# Vivado block design vitis_design, xcvc1902-vsva2197-2MP-e-S, Vivado 2024.1
# (continued, part 3 of 3)
create_bd_cell -type ip -vlnv xilinx.com:ip:axi_noc:1.1 cips_noc
set_property -dict [list \
  CONFIG.NUM_CLKS 10 \
  CONFIG.NUM_MC 0 \
  CONFIG.NUM_MI 1 \
  CONFIG.NUM_NMI 8 \
  CONFIG.NUM_NSI 0 \
  CONFIG.NUM_SI 8 \
] [get_bd_cells cips_noc]
create_bd_cell -type ip -vlnv xilinx.com:ip:axi_noc:1.1 noc_ddr4
set_property -dict [list \
  CONFIG.CH0_DDR4_0_BOARD_INTERFACE ddr4_dimm1 \
  CONFIG.MC_CHAN_REGION0 DDR_LOW0 \
  CONFIG.MC_CHAN_REGION1 DDR_LOW1 \
  CONFIG.MC_DDR4_2T Disable \
  CONFIG.MC_F1_LPDDR4_MR1 0x0000 \
  CONFIG.MC_F1_LPDDR4_MR2 0x0000 \
  CONFIG.MC_F1_TRCD 13750 \
  CONFIG.MC_F1_TRCDMIN 13750 \
  CONFIG.MC_PRE_DEF_ADDR_MAP_SEL ROW_COLUMN_BANK \
  CONFIG.MC_TRC 45750 \
  CONFIG.MC_TRCD 13750 \
  CONFIG.MC_TRCDMIN 13750 \
  CONFIG.MC_TRCMIN 45750 \
  CONFIG.MC_TRP 13750 \
  CONFIG.MC_TRPMIN 13750 \
  CONFIG.NUM_CLKS 1 \
  CONFIG.NUM_MC 1 \
  CONFIG.NUM_MCP 4 \
  CONFIG.NUM_MI 0 \
  CONFIG.NUM_NSI 4 \
  CONFIG.NUM_SI 3 \
  CONFIG.sys_clk0_BOARD_INTERFACE ddr4_dimm1_sma_clk \
] [get_bd_cells noc_ddr4]
create_bd_cell -type ip -vlnv xilinx.com:ip:axi_noc:1.1 noc_lpddr4
set_property -dict [list \
  CONFIG.CH0_LPDDR4_0_BOARD_INTERFACE ch0_lpddr4_c0 \
  CONFIG.CH0_LPDDR4_1_BOARD_INTERFACE ch0_lpddr4_c1 \
  CONFIG.CH1_LPDDR4_0_BOARD_INTERFACE ch1_lpddr4_c0 \
  CONFIG.CH1_LPDDR4_1_BOARD_INTERFACE ch1_lpddr4_c1 \
  CONFIG.MC_CHAN_REGION0 DDR_CH1 \
  CONFIG.MC_CHAN_REGION1 NONE \
  CONFIG.NUM_CLKS 0 \
  CONFIG.NUM_MCP 4 \
  CONFIG.NUM_MI 0 \
  CONFIG.NUM_NSI 4 \
  CONFIG.NUM_SI 0 \
  CONFIG.sys_clk0_BOARD_INTERFACE lpddr4_sma_clk1 \
  CONFIG.sys_clk1_BOARD_INTERFACE lpddr4_sma_clk2 \
] [get_bd_cells noc_lpddr4]
create_bd_cell -type ip -vlnv xilinx.com:ip:ai_engine:2.0 ai_engine_0
set_property -dict [list \
  CONFIG.AIE_CORE_REF_CTRL_FREQMHZ 1250 \
  CONFIG.CLK_NAMES aclk0, \
  CONFIG.C_EN_EXT_RST 1 \
  CONFIG.NAME_MI_AXIS M00_AXIS, \
  CONFIG.NAME_SI_AXI S00_AXI, \
  CONFIG.NAME_SI_AXIS S00_AXIS,S01_AXIS, \
  CONFIG.NUM_CLKS 1 \
  CONFIG.NUM_MI_AXI 0 \
  CONFIG.NUM_MI_AXIS 1 \
  CONFIG.NUM_SI_AXI 1 \
  CONFIG.NUM_SI_AXIS 2 \
] [get_bd_cells ai_engine_0]
create_bd_cell -type ip -vlnv xilinx.com:ip:axi_intc:4.1 axi_intc_cascaded_1
set_property -dict {CONFIG.C_ASYNC_INTR 0xFFFFFFFF CONFIG.C_IRQ_CONNECTION 1} [get_bd_cells axi_intc_cascaded_1]
create_bd_cell -type ip -vlnv xilinx.com:ip:axi_intc:4.1 axi_intc_parent
set_property -dict {CONFIG.C_ASYNC_INTR 0xFFFFFFFF CONFIG.C_IRQ_CONNECTION 1} [get_bd_cells axi_intc_parent]
create_bd_cell -type ip -vlnv xilinx.com:ip:xlconcat:2.1 xlconcat_0
set_property -dict {CONFIG.IN0_WIDTH 1 CONFIG.NUM_PORTS 32} [get_bd_cells xlconcat_0]
create_bd_cell -type ip -vlnv xilinx.com:ip:clk_wizard:1.0 clk_wizard_0
set_property -dict [list \
  CONFIG.CE_TYPE HARDSYNC \
  CONFIG.CLKOUT_DRIVES BUFG,BUFG,BUFG,MBUFGCE,BUFG,BUFG,BUFG \
  CONFIG.CLKOUT_DYN_PS None,None,None,None,None,None,None \
  CONFIG.CLKOUT_GROUPING Auto,Auto,Auto,Auto,Auto,Auto,Auto \
  CONFIG.CLKOUT_MATCHED_ROUTING false,false,false,false,false,false,false \
  CONFIG.CLKOUT_PORT clk_out1,clk_out2,clk_out3,clk_out4_o1,clk_out4_o2,clk_out4_o3,clk_out4_o4 \
  CONFIG.CLKOUT_REQUESTED_DUTY_CYCLE 50.000,50.000,50.000,50.000,50.000,50.000,50.000 \
  CONFIG.CLKOUT_REQUESTED_OUT_FREQUENCY 104.167,208.33,416.67,625,312.5,156.25,78.125 \
  CONFIG.CLKOUT_REQUESTED_PHASE 0.000,0.000,0.000,0.000,0.000,0.000,0.000 \
  CONFIG.CLKOUT_USED true,true,true,true,false,false,false \
  CONFIG.JITTER_SEL Min_O_Jitter \
  CONFIG.PRIM_IN_FREQ 100.000 \
  CONFIG.PRIM_SOURCE Global_buffer \
  CONFIG.RESET_TYPE ACTIVE_LOW \
  CONFIG.USE_PHASE_ALIGNMENT true \
] [get_bd_cells clk_wizard_0]
create_bd_cell -type ip -vlnv xilinx.com:ip:proc_sys_reset:5.0 psr_104mhz
create_bd_cell -type ip -vlnv xilinx.com:ip:proc_sys_reset:5.0 psr_156mhz
create_bd_cell -type ip -vlnv xilinx.com:ip:proc_sys_reset:5.0 psr_312mhz
create_bd_cell -type ip -vlnv xilinx.com:ip:proc_sys_reset:5.0 psr_78mhz
create_bd_cell -type ip -vlnv xilinx.com:ip:proc_sys_reset:5.0 psr_208mhz
create_bd_cell -type ip -vlnv xilinx.com:ip:proc_sys_reset:5.0 psr_416mhz
create_bd_cell -type ip -vlnv xilinx.com:ip:proc_sys_reset:5.0 psr_625mhz
create_bd_cell -type ip -vlnv xilinx.com:ip:smartconnect:1.0 icn_ctrl_1
set_property -dict {CONFIG.NUM_CLKS 3 CONFIG.NUM_MI 11 CONFIG.NUM_SI 1} [get_bd_cells icn_ctrl_1]
create_bd_cell -type ip -vlnv xilinx.com:ip:smartconnect:1.0 icn_ctrl_2
set_property -dict {CONFIG.NUM_CLKS 1 CONFIG.NUM_MI 1 CONFIG.NUM_SI 1} [get_bd_cells icn_ctrl_2]
create_bd_cell -type ip -vlnv xilinx.com:ip:axi_vip:1.1 dummy_slave_0
set_property -dict {CONFIG.INTERFACE_MODE SLAVE CONFIG.PROTOCOL AXI4LITE} [get_bd_cells dummy_slave_0]
create_bd_cell -type ip -vlnv xilinx.com:ip:axi_vip:1.1 dummy_slave_1
set_property -dict {CONFIG.INTERFACE_MODE SLAVE CONFIG.PROTOCOL AXI4LITE} [get_bd_cells dummy_slave_1]
create_bd_cell -type ip -vlnv xilinx.com:ip:axi_vip:1.1 dummy_slave_2
set_property -dict {CONFIG.INTERFACE_MODE SLAVE CONFIG.PROTOCOL AXI4LITE} [get_bd_cells dummy_slave_2]
create_bd_cell -type ip -vlnv xilinx.com:ip:axi_vip:1.1 dummy_slave_3
set_property -dict {CONFIG.INTERFACE_MODE SLAVE CONFIG.PROTOCOL AXI4LITE} [get_bd_cells dummy_slave_3]
create_bd_cell -type ip -vlnv xilinx.com:ip:smartconnect:1.0 icn_ctrl_3
set_property -dict {CONFIG.NUM_CLKS 1 CONFIG.NUM_MI 1 CONFIG.NUM_SI 1} [get_bd_cells icn_ctrl_3]
create_bd_cell -type ip -vlnv xilinx.com:ip:smartconnect:1.0 icn_ctrl_4
set_property -dict {CONFIG.NUM_CLKS 1 CONFIG.NUM_MI 1 CONFIG.NUM_SI 1} [get_bd_cells icn_ctrl_4]
create_bd_cell -type ip -vlnv xilinx.com:ip:smartconnect:1.0 icn_ctrl_5
set_property -dict {CONFIG.NUM_CLKS 1 CONFIG.NUM_MI 1 CONFIG.NUM_SI 1} [get_bd_cells icn_ctrl_5]
create_bd_cell -type ip -vlnv xilinx.com:ip:xlconstant:1.1 xlconstant_0
create_bd_cell -type hier VitisRegion

# ---- hierarchy /VitisRegion ----
current_bd_instance /VitisRegion
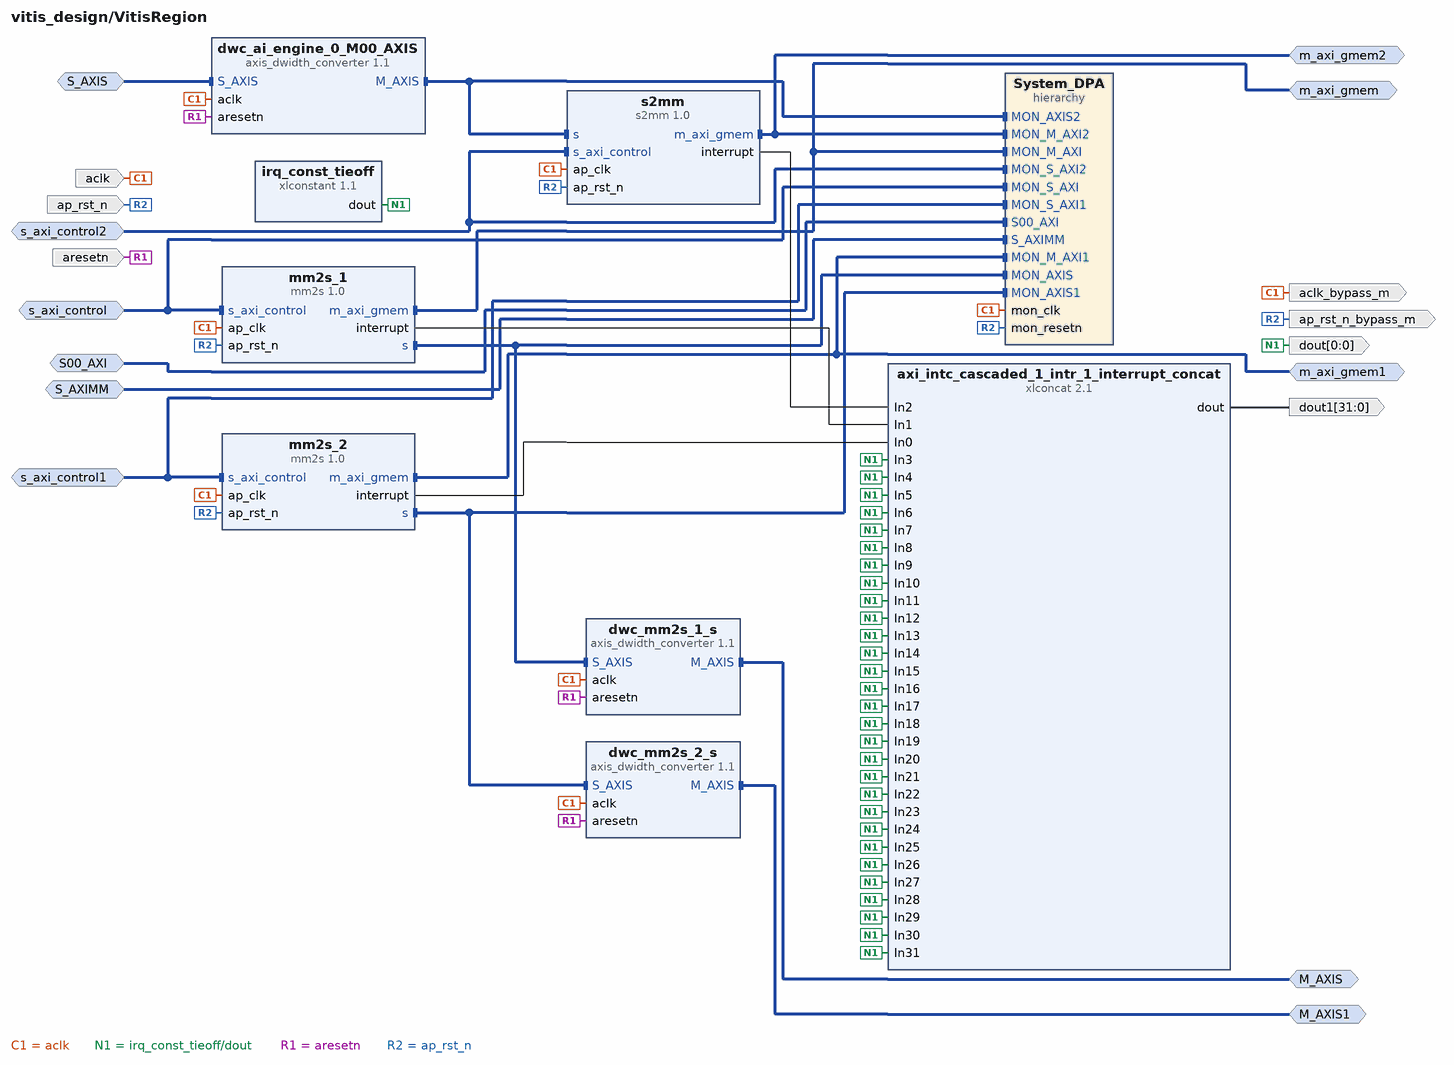
[diagram p1: block diagram inside /VitisRegion]
create_bd_intf_pin -mode Slave -vlnv xilinx.com:interface:aximm_rtl:1.0 S00_AXI
create_bd_intf_pin -mode Slave -vlnv xilinx.com:interface:aximm_rtl:1.0 S_AXIMM
create_bd_intf_pin -mode Master -vlnv xilinx.com:interface:aximm_rtl:1.0 m_axi_gmem
create_bd_intf_pin -mode Slave -vlnv xilinx.com:interface:aximm_rtl:1.0 s_axi_control
create_bd_intf_pin -mode Master -vlnv xilinx.com:interface:aximm_rtl:1.0 m_axi_gmem1
create_bd_intf_pin -mode Slave -vlnv xilinx.com:interface:aximm_rtl:1.0 s_axi_control1
create_bd_intf_pin -mode Master -vlnv xilinx.com:interface:aximm_rtl:1.0 m_axi_gmem2
create_bd_intf_pin -mode Slave -vlnv xilinx.com:interface:aximm_rtl:1.0 s_axi_control2
create_bd_intf_pin -mode Slave -vlnv xilinx.com:interface:axis_rtl:1.0 S_AXIS
create_bd_intf_pin -mode Master -vlnv xilinx.com:interface:axis_rtl:1.0 M_AXIS
create_bd_intf_pin -mode Master -vlnv xilinx.com:interface:axis_rtl:1.0 M_AXIS1
create_bd_pin -dir I -type clk aclk
create_bd_pin -dir I -type rst ap_rst_n
create_bd_pin -dir O -from 0 -to 0 dout
create_bd_pin -dir O -from 31 -to 0 dout1
create_bd_pin -dir I -type rst aresetn
create_bd_pin -dir O -type clk aclk_bypass_m
create_bd_pin -dir O -type rst ap_rst_n_bypass_m

create_bd_cell -type hier System_DPA
create_bd_cell -type ip -vlnv xilinx.com:ip:xlconcat:2.1 axi_intc_cascaded_1_intr_1_interrupt_concat
set_property -dict {CONFIG.NUM_PORTS 32} [get_bd_cells axi_intc_cascaded_1_intr_1_interrupt_concat]
create_bd_cell -type ip -vlnv xilinx.com:ip:axis_dwidth_converter:1.1 dwc_ai_engine_0_M00_AXIS
set_property -dict {CONFIG.M_TDATA_NUM_BYTES 4 CONFIG.S_TDATA_NUM_BYTES 16} [get_bd_cells dwc_ai_engine_0_M00_AXIS]
create_bd_cell -type ip -vlnv xilinx.com:ip:axis_dwidth_converter:1.1 dwc_mm2s_1_s
set_property -dict {CONFIG.M_TDATA_NUM_BYTES 16 CONFIG.S_TDATA_NUM_BYTES 4} [get_bd_cells dwc_mm2s_1_s]
create_bd_cell -type ip -vlnv xilinx.com:ip:axis_dwidth_converter:1.1 dwc_mm2s_2_s
set_property -dict {CONFIG.M_TDATA_NUM_BYTES 16 CONFIG.S_TDATA_NUM_BYTES 4} [get_bd_cells dwc_mm2s_2_s]
create_bd_cell -type ip -vlnv xilinx.com:ip:xlconstant:1.1 irq_const_tieoff
set_property -dict {CONFIG.CONST_VAL 0 CONFIG.CONST_WIDTH 1} [get_bd_cells irq_const_tieoff]
create_bd_cell -type ip -vlnv xilinx.com:hls:mm2s:1.0 mm2s_1
create_bd_cell -type ip -vlnv xilinx.com:hls:mm2s:1.0 mm2s_2
create_bd_cell -type ip -vlnv xilinx.com:hls:s2mm:1.0 s2mm

# ---- hierarchy /VitisRegion/System_DPA ----
current_bd_instance /VitisRegion/System_DPA
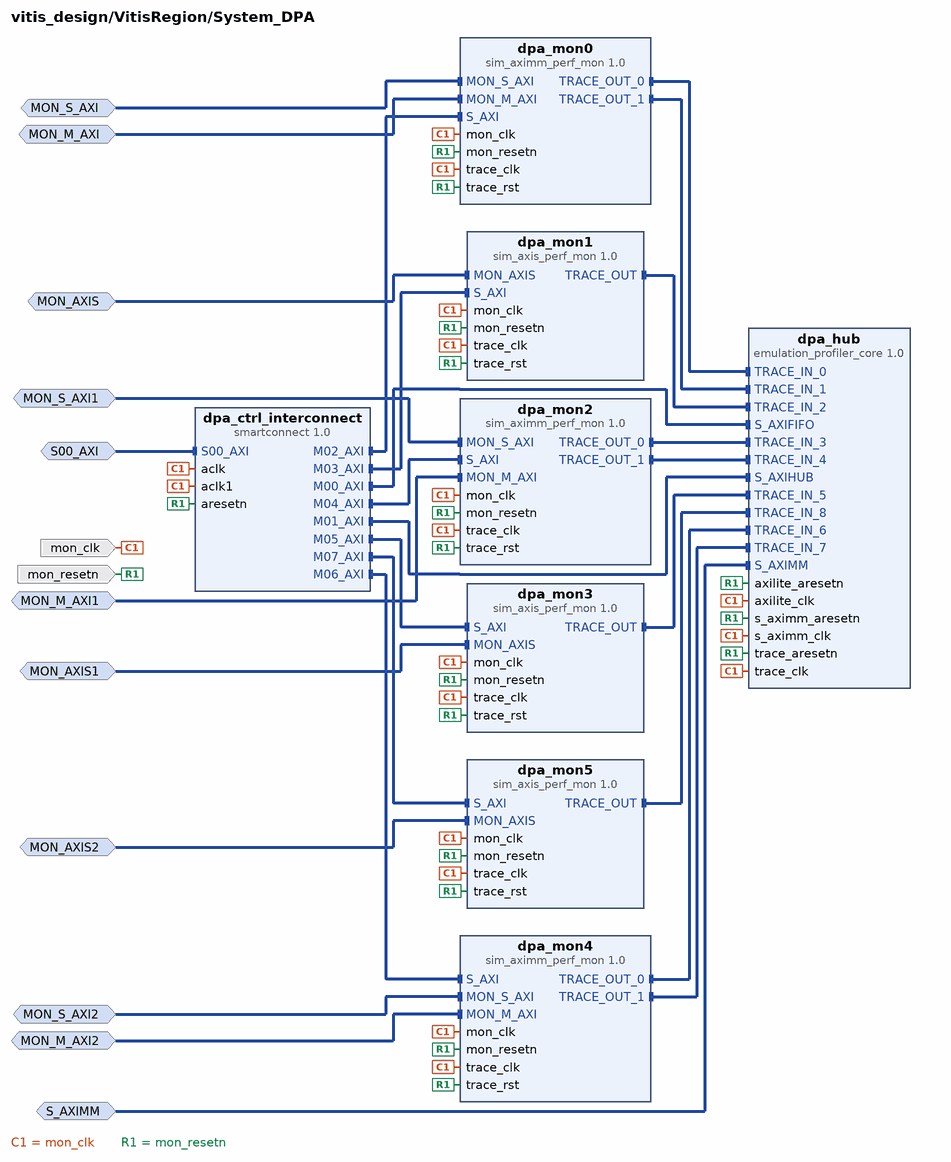
[diagram p2: block diagram inside /VitisRegion/System_DPA]
create_bd_intf_pin -mode Slave -vlnv xilinx.com:interface:aximm_rtl:1.0 S00_AXI
create_bd_intf_pin -mode Slave -vlnv xilinx.com:interface:aximm_rtl:1.0 S_AXIMM
create_bd_intf_pin -mode Monitor -vlnv xilinx.com:interface:aximm_rtl:1.0 MON_M_AXI
create_bd_intf_pin -mode Monitor -vlnv xilinx.com:interface:aximm_rtl:1.0 MON_S_AXI
create_bd_intf_pin -mode Monitor -vlnv xilinx.com:interface:axis_rtl:1.0 MON_AXIS
create_bd_intf_pin -mode Monitor -vlnv xilinx.com:interface:aximm_rtl:1.0 MON_M_AXI1
create_bd_intf_pin -mode Monitor -vlnv xilinx.com:interface:aximm_rtl:1.0 MON_S_AXI1
create_bd_intf_pin -mode Monitor -vlnv xilinx.com:interface:axis_rtl:1.0 MON_AXIS1
create_bd_intf_pin -mode Monitor -vlnv xilinx.com:interface:aximm_rtl:1.0 MON_M_AXI2
create_bd_intf_pin -mode Monitor -vlnv xilinx.com:interface:aximm_rtl:1.0 MON_S_AXI2
create_bd_intf_pin -mode Monitor -vlnv xilinx.com:interface:axis_rtl:1.0 MON_AXIS2
create_bd_pin -dir I -type clk mon_clk
create_bd_pin -dir I -type rst mon_resetn

create_bd_cell -type ip -vlnv xilinx.com:ip:smartconnect:1.0 dpa_ctrl_interconnect
set_property -dict {CONFIG.HAS_ARESETN 1 CONFIG.NUM_CLKS 2 CONFIG.NUM_MI 8 CONFIG.NUM_SI 1} [get_bd_cells dpa_ctrl_interconnect]
create_bd_cell -type ip -vlnv xilinx.com:ip:emulation_profiler_core:1.0 dpa_hub
set_property -dict [list \
  CONFIG.NUM_TRACE_PORTS 9 \
  CONFIG.S_AXIMM_ADDR_RANGE 16777216 \
  CONFIG.S_AXIMM_DATA_WIDTH 32 \
] [get_bd_cells dpa_hub]
create_bd_cell -type ip -vlnv xilinx.com:ip:sim_aximm_perf_mon:1.0 dpa_mon0
set_property -dict [list \
  CONFIG.CAPTURE_BURSTS 0 \
  CONFIG.COUNT_WIDTH 64 \
  CONFIG.ENABLE_COUNTERS true \
  CONFIG.ENABLE_DEBUG true \
  CONFIG.ENABLE_TRACE true \
  CONFIG.EN_AXI_LITE 1 \
  CONFIG.MODE_SDACCEL true \
  CONFIG.MONITOR_ID mm2s_1:m_axi_gmem-DDR \
  CONFIG.TRACE_READ_ID 0 \
  CONFIG.TRACE_WRITE_ID 1 \
] [get_bd_cells dpa_mon0]
create_bd_cell -type ip -vlnv xilinx.com:ip:sim_axis_perf_mon:1.0 dpa_mon1
set_property -dict [list \
  CONFIG.DETAILED_TRACE 1 \
  CONFIG.ENABLE_TRACE 1 \
  CONFIG.EN_AXI_LITE true \
  CONFIG.MONITOR_ID mm2s_1:s-dwc_mm2s_1_s:S_AXIS \
  CONFIG.TRACE_ID 576 \
] [get_bd_cells dpa_mon1]
create_bd_cell -type ip -vlnv xilinx.com:ip:sim_aximm_perf_mon:1.0 dpa_mon2
set_property -dict [list \
  CONFIG.CAPTURE_BURSTS 0 \
  CONFIG.COUNT_WIDTH 64 \
  CONFIG.ENABLE_COUNTERS true \
  CONFIG.ENABLE_DEBUG true \
  CONFIG.ENABLE_TRACE true \
  CONFIG.EN_AXI_LITE 1 \
  CONFIG.MODE_SDACCEL true \
  CONFIG.MONITOR_ID mm2s_2:m_axi_gmem-DDR \
  CONFIG.TRACE_READ_ID 2 \
  CONFIG.TRACE_WRITE_ID 3 \
] [get_bd_cells dpa_mon2]
create_bd_cell -type ip -vlnv xilinx.com:ip:sim_axis_perf_mon:1.0 dpa_mon3
set_property -dict [list \
  CONFIG.DETAILED_TRACE 1 \
  CONFIG.ENABLE_TRACE 1 \
  CONFIG.EN_AXI_LITE true \
  CONFIG.MONITOR_ID mm2s_2:s-dwc_mm2s_2_s:S_AXIS \
  CONFIG.TRACE_ID 577 \
] [get_bd_cells dpa_mon3]
create_bd_cell -type ip -vlnv xilinx.com:ip:sim_aximm_perf_mon:1.0 dpa_mon4
set_property -dict [list \
  CONFIG.CAPTURE_BURSTS 0 \
  CONFIG.COUNT_WIDTH 64 \
  CONFIG.ENABLE_COUNTERS true \
  CONFIG.ENABLE_DEBUG true \
  CONFIG.ENABLE_TRACE true \
  CONFIG.EN_AXI_LITE 1 \
  CONFIG.MODE_SDACCEL true \
  CONFIG.MONITOR_ID s2mm:m_axi_gmem-DDR \
  CONFIG.TRACE_READ_ID 4 \
  CONFIG.TRACE_WRITE_ID 5 \
] [get_bd_cells dpa_mon4]
create_bd_cell -type ip -vlnv xilinx.com:ip:sim_axis_perf_mon:1.0 dpa_mon5
set_property -dict [list \
  CONFIG.DETAILED_TRACE 1 \
  CONFIG.ENABLE_TRACE 1 \
  CONFIG.EN_AXI_LITE true \
  CONFIG.MONITOR_ID dwc_ai_engine_0_M00_AXIS:M_AXIS-s2mm:s \
  CONFIG.TRACE_ID 578 \
] [get_bd_cells dpa_mon5]

# ---- connections ----

current_bd_instance /VitisRegion
connect_bd_intf_net -intf_net ai_engine_0_M00_AXIS [get_bd_intf_pins S_AXIS] [get_bd_intf_pins dwc_ai_engine_0_M00_AXIS/S_AXIS]
connect_bd_intf_net [get_bd_intf_pins dwc_ai_engine_0_M00_AXIS/M_AXIS] [get_bd_intf_pins s2mm/s]
connect_bd_intf_net [get_bd_intf_pins dwc_ai_engine_0_M00_AXIS/M_AXIS] [get_bd_intf_pins System_DPA/MON_AXIS2]
connect_bd_intf_net [get_bd_intf_pins M_AXIS] [get_bd_intf_pins dwc_mm2s_1_s/M_AXIS]
connect_bd_intf_net [get_bd_intf_pins M_AXIS1] [get_bd_intf_pins dwc_mm2s_2_s/M_AXIS]
connect_bd_intf_net -intf_net icn_ctrl_1_M06_AXI [get_bd_intf_pins s_axi_control] [get_bd_intf_pins mm2s_1/s_axi_control]
connect_bd_intf_net [get_bd_intf_pins s_axi_control] [get_bd_intf_pins System_DPA/MON_S_AXI]
connect_bd_intf_net -intf_net icn_ctrl_1_M07_AXI [get_bd_intf_pins s_axi_control1] [get_bd_intf_pins mm2s_2/s_axi_control]
connect_bd_intf_net [get_bd_intf_pins s_axi_control1] [get_bd_intf_pins System_DPA/MON_S_AXI1]
connect_bd_intf_net -intf_net icn_ctrl_1_M08_AXI [get_bd_intf_pins s_axi_control2] [get_bd_intf_pins s2mm/s_axi_control]
connect_bd_intf_net [get_bd_intf_pins s_axi_control2] [get_bd_intf_pins System_DPA/MON_S_AXI2]
connect_bd_intf_net -intf_net icn_ctrl_1_M09_AXI [get_bd_intf_pins S00_AXI] [get_bd_intf_pins System_DPA/S00_AXI]
connect_bd_intf_net -intf_net icn_ctrl_1_M10_AXI [get_bd_intf_pins S_AXIMM] [get_bd_intf_pins System_DPA/S_AXIMM]
connect_bd_intf_net [get_bd_intf_pins m_axi_gmem] [get_bd_intf_pins mm2s_1/m_axi_gmem]
connect_bd_intf_net [get_bd_intf_pins m_axi_gmem] [get_bd_intf_pins System_DPA/MON_M_AXI]
connect_bd_intf_net [get_bd_intf_pins mm2s_1/s] [get_bd_intf_pins dwc_mm2s_1_s/S_AXIS]
connect_bd_intf_net [get_bd_intf_pins mm2s_1/s] [get_bd_intf_pins System_DPA/MON_AXIS]
connect_bd_intf_net [get_bd_intf_pins m_axi_gmem1] [get_bd_intf_pins mm2s_2/m_axi_gmem]
connect_bd_intf_net [get_bd_intf_pins m_axi_gmem1] [get_bd_intf_pins System_DPA/MON_M_AXI1]
connect_bd_intf_net [get_bd_intf_pins mm2s_2/s] [get_bd_intf_pins dwc_mm2s_2_s/S_AXIS]
connect_bd_intf_net [get_bd_intf_pins mm2s_2/s] [get_bd_intf_pins System_DPA/MON_AXIS1]
connect_bd_intf_net [get_bd_intf_pins m_axi_gmem2] [get_bd_intf_pins s2mm/m_axi_gmem]
connect_bd_intf_net [get_bd_intf_pins m_axi_gmem2] [get_bd_intf_pins System_DPA/MON_M_AXI2]
connect_bd_net [get_bd_pins axi_intc_cascaded_1_intr_1_interrupt_concat/dout] [get_bd_pins dout1]
connect_bd_net -net clk_wizard_0_clk_out4_o1_o2 [get_bd_pins aclk] \
  [get_bd_pins dwc_ai_engine_0_M00_AXIS/aclk] [get_bd_pins dwc_mm2s_1_s/aclk] [get_bd_pins dwc_mm2s_2_s/aclk] \
  [get_bd_pins mm2s_1/ap_clk] [get_bd_pins mm2s_2/ap_clk] [get_bd_pins s2mm/ap_clk] [get_bd_pins System_DPA/mon_clk] \
  [get_bd_pins aclk_bypass_m]
connect_bd_net [get_bd_pins irq_const_tieoff/dout] \
  [get_bd_pins dout] [get_bd_pins axi_intc_cascaded_1_intr_1_interrupt_concat/In4] \
  [get_bd_pins axi_intc_cascaded_1_intr_1_interrupt_concat/In5] [get_bd_pins axi_intc_cascaded_1_intr_1_interrupt_concat/In6] \
  [get_bd_pins axi_intc_cascaded_1_intr_1_interrupt_concat/In7] [get_bd_pins axi_intc_cascaded_1_intr_1_interrupt_concat/In8] \
  [get_bd_pins axi_intc_cascaded_1_intr_1_interrupt_concat/In9] \
  [get_bd_pins axi_intc_cascaded_1_intr_1_interrupt_concat/In10] \
  [get_bd_pins axi_intc_cascaded_1_intr_1_interrupt_concat/In11] \
  [get_bd_pins axi_intc_cascaded_1_intr_1_interrupt_concat/In12] \
  [get_bd_pins axi_intc_cascaded_1_intr_1_interrupt_concat/In13] \
  [get_bd_pins axi_intc_cascaded_1_intr_1_interrupt_concat/In14] \
  [get_bd_pins axi_intc_cascaded_1_intr_1_interrupt_concat/In15] \
  [get_bd_pins axi_intc_cascaded_1_intr_1_interrupt_concat/In16] \
  [get_bd_pins axi_intc_cascaded_1_intr_1_interrupt_concat/In17] \
  [get_bd_pins axi_intc_cascaded_1_intr_1_interrupt_concat/In18] \
  [get_bd_pins axi_intc_cascaded_1_intr_1_interrupt_concat/In19] \
  [get_bd_pins axi_intc_cascaded_1_intr_1_interrupt_concat/In20] \
  [get_bd_pins axi_intc_cascaded_1_intr_1_interrupt_concat/In21] \
  [get_bd_pins axi_intc_cascaded_1_intr_1_interrupt_concat/In22] \
  [get_bd_pins axi_intc_cascaded_1_intr_1_interrupt_concat/In23] \
  [get_bd_pins axi_intc_cascaded_1_intr_1_interrupt_concat/In24] \
  [get_bd_pins axi_intc_cascaded_1_intr_1_interrupt_concat/In25] \
  [get_bd_pins axi_intc_cascaded_1_intr_1_interrupt_concat/In26] \
  [get_bd_pins axi_intc_cascaded_1_intr_1_interrupt_concat/In27] \
  [get_bd_pins axi_intc_cascaded_1_intr_1_interrupt_concat/In28] \
  [get_bd_pins axi_intc_cascaded_1_intr_1_interrupt_concat/In29] \
  [get_bd_pins axi_intc_cascaded_1_intr_1_interrupt_concat/In30] \
  [get_bd_pins axi_intc_cascaded_1_intr_1_interrupt_concat/In31] \
  [get_bd_pins axi_intc_cascaded_1_intr_1_interrupt_concat/In3]
connect_bd_net [get_bd_pins mm2s_1/interrupt] [get_bd_pins axi_intc_cascaded_1_intr_1_interrupt_concat/In1]
connect_bd_net [get_bd_pins mm2s_2/interrupt] [get_bd_pins axi_intc_cascaded_1_intr_1_interrupt_concat/In0]
connect_bd_net -net psr_312mhz_interconnect_aresetn [get_bd_pins aresetn] \
  [get_bd_pins dwc_mm2s_1_s/aresetn] [get_bd_pins dwc_mm2s_2_s/aresetn] [get_bd_pins dwc_ai_engine_0_M00_AXIS/aresetn]
connect_bd_net -net psr_312mhz_peripheral_aresetn [get_bd_pins ap_rst_n] \
  [get_bd_pins mm2s_1/ap_rst_n] [get_bd_pins mm2s_2/ap_rst_n] [get_bd_pins s2mm/ap_rst_n] [get_bd_pins System_DPA/mon_resetn] \
  [get_bd_pins ap_rst_n_bypass_m]
connect_bd_net [get_bd_pins s2mm/interrupt] [get_bd_pins axi_intc_cascaded_1_intr_1_interrupt_concat/In2]

current_bd_instance /VitisRegion/System_DPA
connect_bd_intf_net [get_bd_intf_pins dpa_hub/S_AXIFIFO] [get_bd_intf_pins dpa_ctrl_interconnect/M00_AXI]
connect_bd_intf_net [get_bd_intf_pins dpa_hub/S_AXIHUB] [get_bd_intf_pins dpa_ctrl_interconnect/M01_AXI]
connect_bd_intf_net [get_bd_intf_pins dpa_mon0/S_AXI] [get_bd_intf_pins dpa_ctrl_interconnect/M02_AXI]
connect_bd_intf_net [get_bd_intf_pins dpa_mon1/S_AXI] [get_bd_intf_pins dpa_ctrl_interconnect/M03_AXI]
connect_bd_intf_net [get_bd_intf_pins dpa_mon2/S_AXI] [get_bd_intf_pins dpa_ctrl_interconnect/M04_AXI]
connect_bd_intf_net [get_bd_intf_pins dpa_mon3/S_AXI] [get_bd_intf_pins dpa_ctrl_interconnect/M05_AXI]
connect_bd_intf_net [get_bd_intf_pins dpa_mon4/S_AXI] [get_bd_intf_pins dpa_ctrl_interconnect/M06_AXI]
connect_bd_intf_net [get_bd_intf_pins dpa_mon5/S_AXI] [get_bd_intf_pins dpa_ctrl_interconnect/M07_AXI]
connect_bd_intf_net [get_bd_intf_pins dpa_mon0/TRACE_OUT_0] [get_bd_intf_pins dpa_hub/TRACE_IN_0]
connect_bd_intf_net [get_bd_intf_pins dpa_mon0/TRACE_OUT_1] [get_bd_intf_pins dpa_hub/TRACE_IN_1]
connect_bd_intf_net [get_bd_intf_pins dpa_mon1/TRACE_OUT] [get_bd_intf_pins dpa_hub/TRACE_IN_2]
connect_bd_intf_net [get_bd_intf_pins dpa_mon2/TRACE_OUT_0] [get_bd_intf_pins dpa_hub/TRACE_IN_3]
connect_bd_intf_net [get_bd_intf_pins dpa_mon2/TRACE_OUT_1] [get_bd_intf_pins dpa_hub/TRACE_IN_4]
connect_bd_intf_net [get_bd_intf_pins dpa_mon3/TRACE_OUT] [get_bd_intf_pins dpa_hub/TRACE_IN_5]
connect_bd_intf_net [get_bd_intf_pins dpa_mon4/TRACE_OUT_0] [get_bd_intf_pins dpa_hub/TRACE_IN_6]
connect_bd_intf_net [get_bd_intf_pins dpa_mon4/TRACE_OUT_1] [get_bd_intf_pins dpa_hub/TRACE_IN_7]
connect_bd_intf_net [get_bd_intf_pins dpa_mon5/TRACE_OUT] [get_bd_intf_pins dpa_hub/TRACE_IN_8]
connect_bd_intf_net -intf_net dwc_ai_engine_0_M00_AXIS_M_AXIS [get_bd_intf_pins MON_AXIS2] [get_bd_intf_pins dpa_mon5/MON_AXIS]
connect_bd_intf_net -intf_net icn_ctrl_1_M06_AXI [get_bd_intf_pins MON_S_AXI] [get_bd_intf_pins dpa_mon0/MON_S_AXI]
connect_bd_intf_net -intf_net icn_ctrl_1_M07_AXI [get_bd_intf_pins MON_S_AXI1] [get_bd_intf_pins dpa_mon2/MON_S_AXI]
connect_bd_intf_net -intf_net icn_ctrl_1_M08_AXI [get_bd_intf_pins MON_S_AXI2] [get_bd_intf_pins dpa_mon4/MON_S_AXI]
connect_bd_intf_net -intf_net icn_ctrl_1_M09_AXI [get_bd_intf_pins S00_AXI] [get_bd_intf_pins dpa_ctrl_interconnect/S00_AXI]
connect_bd_intf_net -intf_net icn_ctrl_1_M10_AXI [get_bd_intf_pins S_AXIMM] [get_bd_intf_pins dpa_hub/S_AXIMM]
connect_bd_intf_net -intf_net mm2s_1_m_axi_gmem [get_bd_intf_pins MON_M_AXI] [get_bd_intf_pins dpa_mon0/MON_M_AXI]
connect_bd_intf_net -intf_net mm2s_1_s [get_bd_intf_pins MON_AXIS] [get_bd_intf_pins dpa_mon1/MON_AXIS]
connect_bd_intf_net -intf_net mm2s_2_m_axi_gmem [get_bd_intf_pins MON_M_AXI1] [get_bd_intf_pins dpa_mon2/MON_M_AXI]
connect_bd_intf_net -intf_net mm2s_2_s [get_bd_intf_pins MON_AXIS1] [get_bd_intf_pins dpa_mon3/MON_AXIS]
connect_bd_intf_net -intf_net s2mm_m_axi_gmem [get_bd_intf_pins MON_M_AXI2] [get_bd_intf_pins dpa_mon4/MON_M_AXI]
connect_bd_net -net clk_wizard_0_clk_out4_o1_o2 [get_bd_pins mon_clk] \
  [get_bd_pins dpa_mon0/mon_clk] [get_bd_pins dpa_mon0/trace_clk] [get_bd_pins dpa_mon1/mon_clk] \
  [get_bd_pins dpa_mon1/trace_clk] [get_bd_pins dpa_mon2/mon_clk] [get_bd_pins dpa_mon2/trace_clk] \
  [get_bd_pins dpa_mon3/mon_clk] [get_bd_pins dpa_mon3/trace_clk] [get_bd_pins dpa_mon4/mon_clk] \
  [get_bd_pins dpa_mon4/trace_clk] [get_bd_pins dpa_mon5/mon_clk] [get_bd_pins dpa_mon5/trace_clk] \
  [get_bd_pins dpa_hub/trace_clk] [get_bd_pins dpa_hub/axilite_clk] [get_bd_pins dpa_hub/s_aximm_clk] \
  [get_bd_pins dpa_ctrl_interconnect/aclk1] [get_bd_pins dpa_ctrl_interconnect/aclk]
connect_bd_net -net psr_312mhz_peripheral_aresetn [get_bd_pins mon_resetn] \
  [get_bd_pins dpa_mon0/mon_resetn] [get_bd_pins dpa_mon0/trace_rst] [get_bd_pins dpa_mon1/mon_resetn] \
  [get_bd_pins dpa_mon1/trace_rst] [get_bd_pins dpa_mon2/mon_resetn] [get_bd_pins dpa_mon2/trace_rst] \
  [get_bd_pins dpa_mon3/mon_resetn] [get_bd_pins dpa_mon3/trace_rst] [get_bd_pins dpa_mon4/mon_resetn] \
  [get_bd_pins dpa_mon4/trace_rst] [get_bd_pins dpa_mon5/mon_resetn] [get_bd_pins dpa_mon5/trace_rst] \
  [get_bd_pins dpa_hub/trace_aresetn] [get_bd_pins dpa_hub/axilite_aresetn] [get_bd_pins dpa_hub/s_aximm_aresetn] \
  [get_bd_pins dpa_ctrl_interconnect/aresetn]
set_property HDL_ATTRIBUTE.DPA_IP_FULLNAME /mm2s_1/m_axi_gmem-DDR [get_bd_cells dpa_mon0]
set_property HDL_ATTRIBUTE.DPA_IP_FULLNAME mm2s_1/s-dwc_mm2s_1_s/S_AXIS [get_bd_cells dpa_mon1]
set_property HDL_ATTRIBUTE.DPA_IP_FULLNAME /mm2s_2/m_axi_gmem-DDR [get_bd_cells dpa_mon2]
set_property HDL_ATTRIBUTE.DPA_IP_FULLNAME mm2s_2/s-dwc_mm2s_2_s/S_AXIS [get_bd_cells dpa_mon3]
set_property HDL_ATTRIBUTE.DPA_IP_FULLNAME /s2mm/m_axi_gmem-DDR [get_bd_cells dpa_mon4]
set_property HDL_ATTRIBUTE.DPA_IP_FULLNAME dwc_ai_engine_0_M00_AXIS/M_AXIS-s2mm/s [get_bd_cells dpa_mon5]

current_bd_instance /
connect_bd_intf_net -intf_net CIPS_0_IF_PMC_NOC_AXI_0 [get_bd_intf_pins CIPS_0/PMC_NOC_AXI_0] [get_bd_intf_pins cips_noc/S07_AXI]
connect_bd_intf_net -intf_net CIPS_0_IF_PS_NOC_CCI_0 [get_bd_intf_pins CIPS_0/FPD_CCI_NOC_0] [get_bd_intf_pins cips_noc/S00_AXI]
connect_bd_intf_net -intf_net CIPS_0_IF_PS_NOC_CCI_1 [get_bd_intf_pins CIPS_0/FPD_CCI_NOC_1] [get_bd_intf_pins cips_noc/S01_AXI]
connect_bd_intf_net -intf_net CIPS_0_IF_PS_NOC_CCI_2 [get_bd_intf_pins CIPS_0/FPD_CCI_NOC_2] [get_bd_intf_pins cips_noc/S02_AXI]
connect_bd_intf_net -intf_net CIPS_0_IF_PS_NOC_CCI_3 [get_bd_intf_pins CIPS_0/FPD_CCI_NOC_3] [get_bd_intf_pins cips_noc/S03_AXI]
connect_bd_intf_net -intf_net CIPS_0_IF_PS_NOC_NCI_0 [get_bd_intf_pins CIPS_0/FPD_AXI_NOC_0] [get_bd_intf_pins cips_noc/S04_AXI]
connect_bd_intf_net -intf_net CIPS_0_IF_PS_NOC_NCI_1 [get_bd_intf_pins CIPS_0/FPD_AXI_NOC_1] [get_bd_intf_pins cips_noc/S05_AXI]
connect_bd_intf_net -intf_net CIPS_0_IF_PS_NOC_RPU_0 [get_bd_intf_pins CIPS_0/LPD_AXI_NOC_0] [get_bd_intf_pins cips_noc/S06_AXI]
connect_bd_intf_net -intf_net CIPS_0_M_AXI_GP0 [get_bd_intf_pins CIPS_0/M_AXI_FPD] [get_bd_intf_pins icn_ctrl_1/S00_AXI]
connect_bd_intf_net [get_bd_intf_pins ai_engine_0/M00_AXIS] [get_bd_intf_pins VitisRegion/S_AXIS]
connect_bd_intf_net -intf_net axi_noc_0_CH0_LPDDR4_0 [get_bd_intf_ports ch0_lpddr4_c0] [get_bd_intf_pins noc_lpddr4/CH0_LPDDR4_0]
connect_bd_intf_net -intf_net axi_noc_0_CH0_LPDDR4_1 [get_bd_intf_ports ch0_lpddr4_c1] [get_bd_intf_pins noc_lpddr4/CH0_LPDDR4_1]
connect_bd_intf_net -intf_net axi_noc_0_CH1_LPDDR4_0 [get_bd_intf_ports ch1_lpddr4_c0] [get_bd_intf_pins noc_lpddr4/CH1_LPDDR4_0]
connect_bd_intf_net -intf_net axi_noc_0_CH1_LPDDR4_1 [get_bd_intf_ports ch1_lpddr4_c1] [get_bd_intf_pins noc_lpddr4/CH1_LPDDR4_1]
connect_bd_intf_net [get_bd_intf_pins ai_engine_0/S00_AXI] [get_bd_intf_pins cips_noc/M00_AXI]
connect_bd_intf_net [get_bd_intf_pins noc_ddr4/S00_INI] [get_bd_intf_pins cips_noc/M00_INI]
connect_bd_intf_net [get_bd_intf_pins noc_ddr4/S01_INI] [get_bd_intf_pins cips_noc/M01_INI]
connect_bd_intf_net [get_bd_intf_pins noc_ddr4/S02_INI] [get_bd_intf_pins cips_noc/M02_INI]
connect_bd_intf_net [get_bd_intf_pins noc_ddr4/S03_INI] [get_bd_intf_pins cips_noc/M03_INI]
connect_bd_intf_net [get_bd_intf_pins noc_lpddr4/S00_INI] [get_bd_intf_pins cips_noc/M04_INI]
connect_bd_intf_net [get_bd_intf_pins noc_lpddr4/S01_INI] [get_bd_intf_pins cips_noc/M05_INI]
connect_bd_intf_net [get_bd_intf_pins noc_lpddr4/S02_INI] [get_bd_intf_pins cips_noc/M06_INI]
connect_bd_intf_net [get_bd_intf_pins noc_lpddr4/S03_INI] [get_bd_intf_pins cips_noc/M07_INI]
connect_bd_intf_net [get_bd_intf_ports ddr4_dimm1_sma_clk] [get_bd_intf_pins noc_ddr4/sys_clk0]
connect_bd_intf_net -intf_net dwc_mm2s_1_s_M_AXIS [get_bd_intf_pins VitisRegion/M_AXIS] [get_bd_intf_pins ai_engine_0/S00_AXIS]
connect_bd_intf_net -intf_net dwc_mm2s_2_s_M_AXIS [get_bd_intf_pins VitisRegion/M_AXIS1] [get_bd_intf_pins ai_engine_0/S01_AXIS]
connect_bd_intf_net [get_bd_intf_pins axi_intc_cascaded_1/s_axi] [get_bd_intf_pins icn_ctrl_1/M00_AXI]
connect_bd_intf_net [get_bd_intf_pins axi_intc_parent/s_axi] [get_bd_intf_pins icn_ctrl_1/M01_AXI]
connect_bd_intf_net [get_bd_intf_pins icn_ctrl_1/M02_AXI] [get_bd_intf_pins icn_ctrl_2/S00_AXI]
connect_bd_intf_net [get_bd_intf_pins icn_ctrl_1/M03_AXI] [get_bd_intf_pins icn_ctrl_3/S00_AXI]
connect_bd_intf_net [get_bd_intf_pins icn_ctrl_1/M04_AXI] [get_bd_intf_pins icn_ctrl_4/S00_AXI]
connect_bd_intf_net [get_bd_intf_pins icn_ctrl_1/M05_AXI] [get_bd_intf_pins icn_ctrl_5/S00_AXI]
connect_bd_intf_net [get_bd_intf_pins icn_ctrl_1/M06_AXI] [get_bd_intf_pins VitisRegion/s_axi_control]
connect_bd_intf_net [get_bd_intf_pins icn_ctrl_1/M07_AXI] [get_bd_intf_pins VitisRegion/s_axi_control1]
connect_bd_intf_net [get_bd_intf_pins icn_ctrl_1/M08_AXI] [get_bd_intf_pins VitisRegion/s_axi_control2]
connect_bd_intf_net [get_bd_intf_pins icn_ctrl_1/M09_AXI] [get_bd_intf_pins VitisRegion/S00_AXI]
connect_bd_intf_net [get_bd_intf_pins icn_ctrl_1/M10_AXI] [get_bd_intf_pins VitisRegion/S_AXIMM]
connect_bd_intf_net [get_bd_intf_pins icn_ctrl_2/M00_AXI] [get_bd_intf_pins dummy_slave_0/S_AXI]
connect_bd_intf_net [get_bd_intf_pins icn_ctrl_3/M00_AXI] [get_bd_intf_pins dummy_slave_1/S_AXI]
connect_bd_intf_net [get_bd_intf_pins icn_ctrl_4/M00_AXI] [get_bd_intf_pins dummy_slave_2/S_AXI]
connect_bd_intf_net [get_bd_intf_pins icn_ctrl_5/M00_AXI] [get_bd_intf_pins dummy_slave_3/S_AXI]
connect_bd_intf_net -intf_net lpddr4_sma_clk1_1 [get_bd_intf_ports lpddr4_sma_clk1] [get_bd_intf_pins noc_lpddr4/sys_clk0]
connect_bd_intf_net -intf_net lpddr4_sma_clk2_1 [get_bd_intf_ports lpddr4_sma_clk2] [get_bd_intf_pins noc_lpddr4/sys_clk1]
connect_bd_intf_net -intf_net mm2s_1_m_axi_gmem [get_bd_intf_pins VitisRegion/m_axi_gmem] [get_bd_intf_pins noc_ddr4/S00_AXI]
connect_bd_intf_net -intf_net mm2s_2_m_axi_gmem [get_bd_intf_pins VitisRegion/m_axi_gmem1] [get_bd_intf_pins noc_ddr4/S01_AXI]
connect_bd_intf_net [get_bd_intf_ports ddr4_dimm1] [get_bd_intf_pins noc_ddr4/CH0_DDR4_0]
connect_bd_intf_net -intf_net s2mm_m_axi_gmem [get_bd_intf_pins VitisRegion/m_axi_gmem2] [get_bd_intf_pins noc_ddr4/S02_AXI]
connect_bd_net -net CIPS_0_pl_clk0 [get_bd_pins CIPS_0/pl0_ref_clk] [get_bd_pins clk_wizard_0/clk_in1]
connect_bd_net -net CIPS_0_pl_resetn1 [get_bd_pins CIPS_0/pl0_resetn] \
  [get_bd_pins clk_wizard_0/resetn] [get_bd_pins psr_104mhz/ext_reset_in] [get_bd_pins psr_156mhz/ext_reset_in] \
  [get_bd_pins psr_208mhz/ext_reset_in] [get_bd_pins psr_312mhz/ext_reset_in] [get_bd_pins psr_416mhz/ext_reset_in] \
  [get_bd_pins psr_625mhz/ext_reset_in] [get_bd_pins psr_78mhz/ext_reset_in]
connect_bd_net -net CIPS_0_ps_pmc_noc_axi0_clk [get_bd_pins CIPS_0/pmc_axi_noc_axi0_clk] [get_bd_pins cips_noc/aclk8]
connect_bd_net -net CIPS_0_ps_ps_noc_cci_axi0_clk [get_bd_pins CIPS_0/fpd_cci_noc_axi0_clk] [get_bd_pins cips_noc/aclk1]
connect_bd_net -net CIPS_0_ps_ps_noc_cci_axi1_clk [get_bd_pins CIPS_0/fpd_cci_noc_axi1_clk] [get_bd_pins cips_noc/aclk2]
connect_bd_net -net CIPS_0_ps_ps_noc_cci_axi2_clk [get_bd_pins CIPS_0/fpd_cci_noc_axi2_clk] [get_bd_pins cips_noc/aclk3]
connect_bd_net -net CIPS_0_ps_ps_noc_cci_axi3_clk [get_bd_pins CIPS_0/fpd_cci_noc_axi3_clk] [get_bd_pins cips_noc/aclk4]
connect_bd_net -net CIPS_0_ps_ps_noc_nci_axi0_clk [get_bd_pins CIPS_0/fpd_axi_noc_axi0_clk] [get_bd_pins cips_noc/aclk5]
connect_bd_net -net CIPS_0_ps_ps_noc_nci_axi1_clk [get_bd_pins CIPS_0/fpd_axi_noc_axi1_clk] [get_bd_pins cips_noc/aclk6]
connect_bd_net -net CIPS_0_ps_ps_noc_rpu_axi0_clk [get_bd_pins CIPS_0/lpd_axi_noc_clk] [get_bd_pins cips_noc/aclk7]
connect_bd_net [get_bd_pins VitisRegion/aclk_bypass_m] [get_bd_pins icn_ctrl_1/aclk2] [get_bd_pins noc_ddr4/aclk0] [get_bd_pins ai_engine_0/aclk0]
connect_bd_net [get_bd_pins VitisRegion/ap_rst_n_bypass_m] [get_bd_pins ai_engine_0/aresetn0]
connect_bd_net [get_bd_pins ai_engine_0/s00_axi_aclk] [get_bd_pins cips_noc/aclk9]
connect_bd_net -net axi_intc_3_irq [get_bd_pins axi_intc_parent/irq] [get_bd_pins CIPS_0/pl_ps_irq0]
connect_bd_net -net axi_intc_cascaded_1_intr_1_interrupt_concat_dout [get_bd_pins VitisRegion/dout1] [get_bd_pins axi_intc_cascaded_1/intr]
connect_bd_net [get_bd_pins axi_intc_cascaded_1/irq] [get_bd_pins xlconcat_0/In31]
connect_bd_net [get_bd_pins clk_wizard_0/clk_out1] \
  [get_bd_pins CIPS_0/m_axi_fpd_aclk] [get_bd_pins axi_intc_cascaded_1/s_axi_aclk] [get_bd_pins axi_intc_parent/s_axi_aclk] \
  [get_bd_pins cips_noc/aclk0] [get_bd_pins icn_ctrl_1/aclk] [get_bd_pins icn_ctrl_1/aclk1] [get_bd_pins icn_ctrl_2/aclk] \
  [get_bd_pins icn_ctrl_3/aclk] [get_bd_pins icn_ctrl_4/aclk] [get_bd_pins icn_ctrl_5/aclk] \
  [get_bd_pins psr_104mhz/slowest_sync_clk] [get_bd_pins dummy_slave_0/aclk] [get_bd_pins dummy_slave_1/aclk] \
  [get_bd_pins dummy_slave_2/aclk] [get_bd_pins dummy_slave_3/aclk]
connect_bd_net [get_bd_pins clk_wizard_0/clk_out2] [get_bd_pins psr_208mhz/slowest_sync_clk]
connect_bd_net [get_bd_pins clk_wizard_0/clk_out3] [get_bd_pins psr_416mhz/slowest_sync_clk]
connect_bd_net [get_bd_pins clk_wizard_0/clk_out4_o1_o1] [get_bd_pins psr_625mhz/slowest_sync_clk]
connect_bd_net [get_bd_pins clk_wizard_0/clk_out4_o1_o2] [get_bd_pins psr_312mhz/slowest_sync_clk] [get_bd_pins VitisRegion/aclk]
connect_bd_net [get_bd_pins clk_wizard_0/clk_out4_o1_o3] [get_bd_pins psr_156mhz/slowest_sync_clk]
connect_bd_net [get_bd_pins clk_wizard_0/clk_out4_o1_o4] [get_bd_pins psr_78mhz/slowest_sync_clk]
connect_bd_net [get_bd_pins clk_wizard_0/locked] \
  [get_bd_pins psr_104mhz/dcm_locked] [get_bd_pins psr_156mhz/dcm_locked] [get_bd_pins psr_208mhz/dcm_locked] \
  [get_bd_pins psr_416mhz/dcm_locked] [get_bd_pins psr_625mhz/dcm_locked] [get_bd_pins psr_78mhz/dcm_locked] \
  [get_bd_pins psr_312mhz/dcm_locked]
connect_bd_net -net irq_const_tieoff_dout [get_bd_pins VitisRegion/dout] \
  [get_bd_pins xlconcat_0/In0] [get_bd_pins xlconcat_0/In1] [get_bd_pins xlconcat_0/In2] [get_bd_pins xlconcat_0/In3] \
  [get_bd_pins xlconcat_0/In4] [get_bd_pins xlconcat_0/In5] [get_bd_pins xlconcat_0/In6] [get_bd_pins xlconcat_0/In7] \
  [get_bd_pins xlconcat_0/In8] [get_bd_pins xlconcat_0/In9] [get_bd_pins xlconcat_0/In10] [get_bd_pins xlconcat_0/In11] \
  [get_bd_pins xlconcat_0/In12] [get_bd_pins xlconcat_0/In13] [get_bd_pins xlconcat_0/In14] [get_bd_pins xlconcat_0/In15] \
  [get_bd_pins xlconcat_0/In16] [get_bd_pins xlconcat_0/In17] [get_bd_pins xlconcat_0/In18] [get_bd_pins xlconcat_0/In19] \
  [get_bd_pins xlconcat_0/In20] [get_bd_pins xlconcat_0/In21] [get_bd_pins xlconcat_0/In22] [get_bd_pins xlconcat_0/In23] \
  [get_bd_pins xlconcat_0/In24] [get_bd_pins xlconcat_0/In25] [get_bd_pins xlconcat_0/In26] [get_bd_pins xlconcat_0/In27] \
  [get_bd_pins xlconcat_0/In28] [get_bd_pins xlconcat_0/In29] [get_bd_pins xlconcat_0/In30]
connect_bd_net [get_bd_pins psr_104mhz/peripheral_aresetn] \
  [get_bd_pins axi_intc_cascaded_1/s_axi_aresetn] [get_bd_pins axi_intc_parent/s_axi_aresetn] \
  [get_bd_pins icn_ctrl_1/aresetn] [get_bd_pins icn_ctrl_2/aresetn] [get_bd_pins icn_ctrl_3/aresetn] \
  [get_bd_pins icn_ctrl_4/aresetn] [get_bd_pins icn_ctrl_5/aresetn] [get_bd_pins dummy_slave_0/aresetn] \
  [get_bd_pins dummy_slave_1/aresetn] [get_bd_pins dummy_slave_2/aresetn] [get_bd_pins dummy_slave_3/aresetn]
connect_bd_net [get_bd_pins psr_312mhz/interconnect_aresetn] [get_bd_pins VitisRegion/aresetn]
connect_bd_net [get_bd_pins psr_312mhz/peripheral_aresetn] [get_bd_pins VitisRegion/ap_rst_n]
connect_bd_net [get_bd_pins xlconcat_0/dout] [get_bd_pins axi_intc_parent/intr]
connect_bd_net [get_bd_pins xlconstant_0/dout] [get_bd_pins clk_wizard_0/clk_out4_o1_ce] [get_bd_pins clk_wizard_0/clk_out4_o1_clr_n]

# ---- address map ----
assign_bd_address -offset 0x0000000000000000 -range 2G -target_address_space [get_bd_addr_spaces CIPS_0/FPD_AXI_NOC_0] [get_bd_addr_segs noc_ddr4/S00_INI/C0_DDR_LOW0]
assign_bd_address -offset 0x0000000800000000 -range 6G -target_address_space [get_bd_addr_spaces CIPS_0/FPD_AXI_NOC_0] [get_bd_addr_segs noc_ddr4/S00_INI/C0_DDR_LOW1]
assign_bd_address -offset 0x0000000000000000 -range 2G -target_address_space [get_bd_addr_spaces CIPS_0/FPD_AXI_NOC_1] [get_bd_addr_segs noc_ddr4/S00_INI/C0_DDR_LOW0]
assign_bd_address -offset 0x0000000800000000 -range 6G -target_address_space [get_bd_addr_spaces CIPS_0/FPD_AXI_NOC_1] [get_bd_addr_segs noc_ddr4/S00_INI/C0_DDR_LOW1]
assign_bd_address -offset 0x0000000000000000 -range 2G -target_address_space [get_bd_addr_spaces CIPS_0/FPD_CCI_NOC_0] [get_bd_addr_segs noc_ddr4/S00_INI/C0_DDR_LOW0]
assign_bd_address -offset 0x0000000800000000 -range 6G -target_address_space [get_bd_addr_spaces CIPS_0/FPD_CCI_NOC_0] [get_bd_addr_segs noc_ddr4/S00_INI/C0_DDR_LOW1]
assign_bd_address -offset 0x0000020000000000 -range 4G -target_address_space [get_bd_addr_spaces CIPS_0/FPD_CCI_NOC_0] [get_bd_addr_segs ai_engine_0/S00_AXI/AIE_ARRAY_0]
assign_bd_address -offset 0x0000050000000000 -range 8G -target_address_space [get_bd_addr_spaces CIPS_0/FPD_CCI_NOC_0] [get_bd_addr_segs noc_lpddr4/S00_INI/C0_DDR_CH1x2]
assign_bd_address -offset 0x0000000000000000 -range 2G -target_address_space [get_bd_addr_spaces CIPS_0/FPD_CCI_NOC_1] [get_bd_addr_segs noc_ddr4/S01_INI/C1_DDR_LOW0]
assign_bd_address -offset 0x0000000800000000 -range 6G -target_address_space [get_bd_addr_spaces CIPS_0/FPD_CCI_NOC_1] [get_bd_addr_segs noc_ddr4/S01_INI/C1_DDR_LOW1]
assign_bd_address -offset 0x0000020000000000 -range 4G -target_address_space [get_bd_addr_spaces CIPS_0/FPD_CCI_NOC_1] [get_bd_addr_segs ai_engine_0/S00_AXI/AIE_ARRAY_0]
assign_bd_address -offset 0x0000050000000000 -range 8G -target_address_space [get_bd_addr_spaces CIPS_0/FPD_CCI_NOC_1] [get_bd_addr_segs noc_lpddr4/S01_INI/C1_DDR_CH1x2]
assign_bd_address -offset 0x0000000000000000 -range 2G -target_address_space [get_bd_addr_spaces CIPS_0/FPD_CCI_NOC_2] [get_bd_addr_segs noc_ddr4/S02_INI/C2_DDR_LOW0]
assign_bd_address -offset 0x0000000800000000 -range 6G -target_address_space [get_bd_addr_spaces CIPS_0/FPD_CCI_NOC_2] [get_bd_addr_segs noc_ddr4/S02_INI/C2_DDR_LOW1]
assign_bd_address -offset 0x0000020000000000 -range 4G -target_address_space [get_bd_addr_spaces CIPS_0/FPD_CCI_NOC_2] [get_bd_addr_segs ai_engine_0/S00_AXI/AIE_ARRAY_0]
assign_bd_address -offset 0x0000050000000000 -range 8G -target_address_space [get_bd_addr_spaces CIPS_0/FPD_CCI_NOC_2] [get_bd_addr_segs noc_lpddr4/S02_INI/C2_DDR_CH1x2]
assign_bd_address -offset 0x0000000000000000 -range 2G -target_address_space [get_bd_addr_spaces CIPS_0/FPD_CCI_NOC_3] [get_bd_addr_segs noc_ddr4/S03_INI/C3_DDR_LOW0]
assign_bd_address -offset 0x0000000800000000 -range 6G -target_address_space [get_bd_addr_spaces CIPS_0/FPD_CCI_NOC_3] [get_bd_addr_segs noc_ddr4/S03_INI/C3_DDR_LOW1]
assign_bd_address -offset 0x0000020000000000 -range 4G -target_address_space [get_bd_addr_spaces CIPS_0/FPD_CCI_NOC_3] [get_bd_addr_segs ai_engine_0/S00_AXI/AIE_ARRAY_0]
assign_bd_address -offset 0x0000050000000000 -range 8G -target_address_space [get_bd_addr_spaces CIPS_0/FPD_CCI_NOC_3] [get_bd_addr_segs noc_lpddr4/S03_INI/C3_DDR_CH1x2]
assign_bd_address -offset 0x0000000000000000 -range 2G -target_address_space [get_bd_addr_spaces CIPS_0/LPD_AXI_NOC_0] [get_bd_addr_segs noc_ddr4/S00_INI/C0_DDR_LOW0]
assign_bd_address -offset 0x0000000800000000 -range 6G -target_address_space [get_bd_addr_spaces CIPS_0/LPD_AXI_NOC_0] [get_bd_addr_segs noc_ddr4/S00_INI/C0_DDR_LOW1]
assign_bd_address -offset 0x000A4000000 -range 64K -target_address_space [get_bd_addr_spaces CIPS_0/M_AXI_FPD] [get_bd_addr_segs axi_intc_cascaded_1/S_AXI/Reg]
assign_bd_address -offset 0x000A4010000 -range 64K -target_address_space [get_bd_addr_spaces CIPS_0/M_AXI_FPD] [get_bd_addr_segs dummy_slave_0/S_AXI/Reg]
assign_bd_address -offset 0x000A4020000 -range 64K -target_address_space [get_bd_addr_spaces CIPS_0/M_AXI_FPD] [get_bd_addr_segs dummy_slave_1/S_AXI/Reg]
assign_bd_address -offset 0x000A4030000 -range 64K -target_address_space [get_bd_addr_spaces CIPS_0/M_AXI_FPD] [get_bd_addr_segs dummy_slave_2/S_AXI/Reg]
assign_bd_address -offset 0x000A4040000 -range 64K -target_address_space [get_bd_addr_spaces CIPS_0/M_AXI_FPD] [get_bd_addr_segs dummy_slave_3/S_AXI/Reg]
assign_bd_address -offset 0x000A4050000 -range 64K -target_address_space [get_bd_addr_spaces CIPS_0/M_AXI_FPD] [get_bd_addr_segs VitisRegion/mm2s_1/s_axi_control/Reg]
assign_bd_address -offset 0x000A4060000 -range 64K -target_address_space [get_bd_addr_spaces CIPS_0/M_AXI_FPD] [get_bd_addr_segs VitisRegion/mm2s_2/s_axi_control/Reg]
assign_bd_address -offset 0x000A4070000 -range 64K -target_address_space [get_bd_addr_spaces CIPS_0/M_AXI_FPD] [get_bd_addr_segs VitisRegion/s2mm/s_axi_control/Reg]
assign_bd_address -offset 0x000A4080000 -range 64K -target_address_space [get_bd_addr_spaces CIPS_0/M_AXI_FPD] [get_bd_addr_segs VitisRegion/System_DPA/dpa_hub/S_AXIFIFO/Reg]
assign_bd_address -offset 0x000A4090000 -range 64K -target_address_space [get_bd_addr_spaces CIPS_0/M_AXI_FPD] [get_bd_addr_segs VitisRegion/System_DPA/dpa_hub/S_AXIHUB/Reg]
assign_bd_address -offset 0x000A40A0000 -range 64K -target_address_space [get_bd_addr_spaces CIPS_0/M_AXI_FPD] [get_bd_addr_segs VitisRegion/System_DPA/dpa_mon0/S_AXI/Reg]
assign_bd_address -offset 0x000A40B0000 -range 64K -target_address_space [get_bd_addr_spaces CIPS_0/M_AXI_FPD] [get_bd_addr_segs VitisRegion/System_DPA/dpa_mon1/S_AXI/Reg]
assign_bd_address -offset 0x000A40C0000 -range 64K -target_address_space [get_bd_addr_spaces CIPS_0/M_AXI_FPD] [get_bd_addr_segs VitisRegion/System_DPA/dpa_mon2/S_AXI/Reg]
assign_bd_address -offset 0x000A40D0000 -range 64K -target_address_space [get_bd_addr_spaces CIPS_0/M_AXI_FPD] [get_bd_addr_segs VitisRegion/System_DPA/dpa_mon3/S_AXI/Reg]
assign_bd_address -offset 0x000A40E0000 -range 64K -target_address_space [get_bd_addr_spaces CIPS_0/M_AXI_FPD] [get_bd_addr_segs VitisRegion/System_DPA/dpa_mon4/S_AXI/Reg]
assign_bd_address -offset 0x000A40F0000 -range 64K -target_address_space [get_bd_addr_spaces CIPS_0/M_AXI_FPD] [get_bd_addr_segs VitisRegion/System_DPA/dpa_mon5/S_AXI/Reg]
assign_bd_address -offset 0x000A5000000 -range 64K -target_address_space [get_bd_addr_spaces CIPS_0/M_AXI_FPD] [get_bd_addr_segs axi_intc_parent/S_AXI/Reg]
assign_bd_address -offset 0x000A6000000 -range 16M -target_address_space [get_bd_addr_spaces CIPS_0/M_AXI_FPD] [get_bd_addr_segs VitisRegion/System_DPA/dpa_hub/S_AXIMM_MAP/S_AXIMM_BLOCK]
assign_bd_address -offset 0x0000000000000000 -range 2G -target_address_space [get_bd_addr_spaces CIPS_0/PMC_NOC_AXI_0] [get_bd_addr_segs noc_ddr4/S00_INI/C0_DDR_LOW0]
assign_bd_address -offset 0x0000000800000000 -range 6G -target_address_space [get_bd_addr_spaces CIPS_0/PMC_NOC_AXI_0] [get_bd_addr_segs noc_ddr4/S00_INI/C0_DDR_LOW1]
assign_bd_address -offset 0x0000020000000000 -range 4G -target_address_space [get_bd_addr_spaces CIPS_0/PMC_NOC_AXI_0] [get_bd_addr_segs ai_engine_0/S00_AXI/AIE_ARRAY_0]
assign_bd_address -offset 0x0000050000000000 -range 8G -target_address_space [get_bd_addr_spaces CIPS_0/PMC_NOC_AXI_0] [get_bd_addr_segs noc_lpddr4/S00_INI/C0_DDR_CH1x2]
assign_bd_address -offset 0x0000000000000000 -range 2G -target_address_space [get_bd_addr_spaces VitisRegion/mm2s_1/Data_m_axi_gmem] [get_bd_addr_segs noc_ddr4/S00_AXI/C1_DDR_LOW0]
assign_bd_address -offset 0x0000000800000000 -range 6G -target_address_space [get_bd_addr_spaces VitisRegion/mm2s_1/Data_m_axi_gmem] [get_bd_addr_segs noc_ddr4/S00_AXI/C1_DDR_LOW1]
assign_bd_address -offset 0x0000000000000000 -range 2G -target_address_space [get_bd_addr_spaces VitisRegion/mm2s_2/Data_m_axi_gmem] [get_bd_addr_segs noc_ddr4/S01_AXI/C2_DDR_LOW0]
assign_bd_address -offset 0x0000000800000000 -range 6G -target_address_space [get_bd_addr_spaces VitisRegion/mm2s_2/Data_m_axi_gmem] [get_bd_addr_segs noc_ddr4/S01_AXI/C2_DDR_LOW1]
assign_bd_address -offset 0x0000000000000000 -range 2G -target_address_space [get_bd_addr_spaces VitisRegion/s2mm/Data_m_axi_gmem] [get_bd_addr_segs noc_ddr4/S02_AXI/C3_DDR_LOW0]
assign_bd_address -offset 0x0000000800000000 -range 6G -target_address_space [get_bd_addr_spaces VitisRegion/s2mm/Data_m_axi_gmem] [get_bd_addr_segs noc_ddr4/S02_AXI/C3_DDR_LOW1]

validate_bd_design
save_bd_design
